# Altium schematic sheet MotorDrivers.SchDoc: Motor Drivers A4988
size A4; SheetNumber: 4; SheetTotal: 7
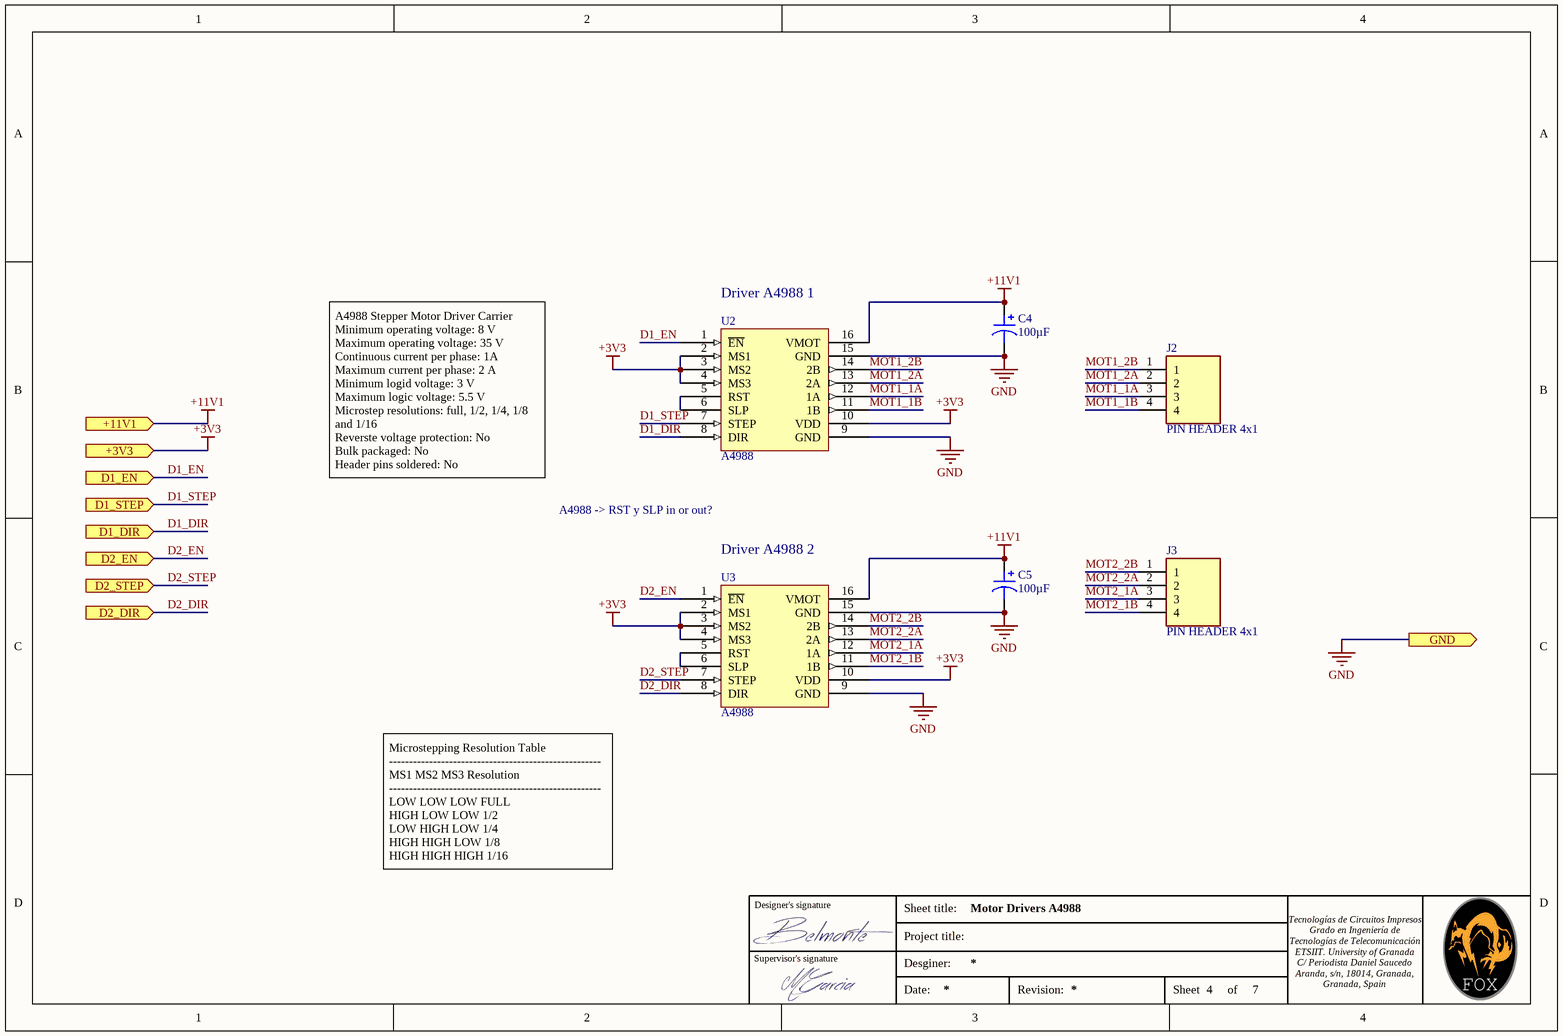
[diagram p0: MotorDrivers.SchDoc]

## Parts
C4  Capacitance: 100µF  [CAP ALSMD POLY 5.3MM H6.1MM]  (hidden comment: ALUM 100uF)
C5  Capacitance: 100µF  [CAP ALSMD POLY 5.3MM H6.1MM]  (hidden comment: ALUM 100uF)
J2  PIN HEADER 4x1  [HDRV4W50P0X200_1X4_800X200X525P]
J3  PIN HEADER 4x1  [HDRV4W50P0X200_1X4_800X200X525P]
U2  A4988  [A4988]
U3  A4988  [A4988]

## Ports
+3V3 (in), +11V1 (in), D1_DIR (in), D1_EN (in), D1_STEP (in), D2_DIR (in), D2_EN (in), D2_STEP (in), GND (out)

## Nets
+3V3: U2.2(MS1) U2.3(MS2) U2.4(MS3) U2.10(VDD) U3.2(MS1) U3.3(MS2) U3.4(MS3) U3.10(VDD) ; port +3V3
+11V1: C4.1 C5.1 U2.16(VMOT) U3.16(VMOT) ; port +11V1
GND: C4.2 C5.2 U2.9(GND) U2.15(GND) U3.9(GND) U3.15(GND) ; port GND
D1_DIR: U2.8(DIR) ; port D1_DIR
D1_EN: U2.1(~{EN}) ; port D1_EN
D1_STEP: U2.7(STEP) ; port D1_STEP
D2_DIR: U3.8(DIR) ; port D2_DIR
D2_EN: U3.1(~{EN}) ; port D2_EN
D2_STEP: U3.7(STEP) ; port D2_STEP
MOT1_1A: J2.3 U2.12(1A)
MOT1_1B: J2.4 U2.11(1B)
MOT1_2A: J2.2 U2.13(2A)
MOT1_2B: J2.1 U2.14(2B)
MOT2_1A: J3.3 U3.12(1A)
MOT2_1B: J3.4 U3.11(1B)
MOT2_2A: J3.2 U3.13(2A)
MOT2_2B: J3.1 U3.14(2B)
NetU2_5: U2.5(RST) U2.6(SLP)
NetU3_5: U3.5(RST) U3.6(SLP)

## Notes on the sheet
- (near U2) Driver A4988 1
- A4988 Stepper Motor Driver Carrier
  Minimum operating voltage: 8 V
  Maximum operating voltage: 35 V
  Continuous current per phase: 1A
  Maximum current per phase: 2 A
  Minimum logid voltage: 3 V
  Maximum logic voltage: 5.5 V
  Microstep resolutions: full, 1/2, 1/4, 1/8 and 1/16
  Reverste voltage protection: No
  Bulk packaged: No
  Header pins soldered: No
- A4988 -> RST y SLP in or out?
- (near U3) Driver A4988 2
- Microstepping Resolution Table
  -----------------------------------------------------
  MS1	MS2	MS3	Resolution
  -----------------------------------------------------
  LOW	LOW	LOW	FULL
  HIGH	LOW	LOW	1/2
  LOW	HIGH	LOW	1/4
  HIGH	HIGH	LOW	1/8
  HIGH	HIGH	HIGH	1/16
- Designer's signature
- Sheet title:
- Supervisor's signature
- Project title:
- Desginer:
- Tecnologías de Circuitos Impresos
  Grado en Ingeniería de Tecnologías de Telecomunicación
  ETSIIT. University of Granada
  C/ Periodista Daniel Saucedo Aranda, s/n, 18014, Granada, Granada, Spain
- Date:
- Revision:
- Sheet
- of

## Library data of the parts
C4 C5 = MAL218497352E3: CAP ALUM 100UF 4V 2000H; Manufacturer: Vishay Beyschlag/Draloric/BC Components; ESR (Equivalent Series Resistance): 25mOhm; Lifetime @ Temp.: 2000 Hrs @ 105°C; Ripple Current @ High Frequency: 2.31A @ 100kHz; Ripple Current @ Low Frequency: 115.5mA @ 120Hz; Surface Mount Land Size: 0.209" L x 0.209" W (5.30mm x 5.30mm); Tolerance: ±20%; Type: Polymer; Value: 100µF; Part Number: MAL218497352E3; Applications: General Purpose; ComponentLink2Description: DigiKey Link; ComponentLink2URL: http://digikey.com/product-detail/en/vishay-beyschlag-draloric-bc-components/MAL218497352E3/56-MAL218497352E3-ND/12814066; Device Package: Radial, Can - SMD; Height - Seated (Max): 0.240" (6.10mm); LastUpdated: 08/30/2020 21:02:23; Lifecycle Status: Active; Minimum Order: 5000; Mounting Type: Surface Mount; Packaging: Box; PartId: 2781; Price: 0.27; Series: 184 CPNS; Size / Dimension: 0.197" Dia (5.00mm); Supplier 1: DigiKey; Supplier Part Number 1: 56-MAL218497352E3-ND
J2 J3 = M22-2510405: Connector; Manufacturer_Name: Harwin; Datasheet Link: https://cdn.harwin.com/pdfs/M22-251.pdf; Height: 5.25mm; Manufacturer_Part_Number: M22-2510405; Mouser Part Number: 855-M22-2510405; Mouser Price/Stock: https://www.mouser.co.uk/ProductDetail/Harwin/M22-2510405?qs=vF78I%252BjhbY9z7PsFZBZ5CA%3D%3D
U2 U3 = A4988: Pololu A4988 Stepper Motor Driver Carrier; ComponentLink1Description: Datasheet carrier; ComponentLink1URL: https://www.robotshop.com/media/files/pdf/datasheet-1182.pdf; ComponentLink2Description: Datasheet A4988; ComponentLink2URL: https://www.pololu.com/file/0J450/a4988_DMOS_microstepping_driver_with_translator.pdf